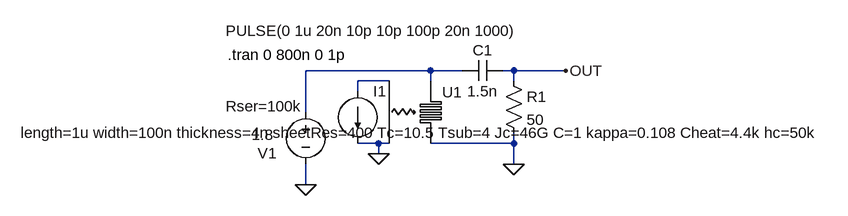
[diagram p0: schematic snspd-biasing-drift.asc]
snspd-biasing-drift.asc, the LTspice schematic file:
Version 4
SHEET 1 880 680
WIRE 208 32 16 32
WIRE 256 32 208 32
WIRE 336 32 320 32
WIRE 416 32 336 32
WIRE 144 48 96 48
WIRE 208 48 208 32
WIRE 336 48 336 32
WIRE 96 64 96 48
WIRE 16 96 16 32
WIRE 128 144 96 144
WIRE 144 144 128 144
WIRE 336 144 336 128
WIRE 336 144 208 144
WIRE 128 160 128 144
WIRE 336 176 336 144
WIRE 16 208 16 176
FLAG 128 160 0
FLAG 16 208 0
FLAG 416 32 OUT
FLAG 336 176 0
SYMBOL snspdWithPhotonPort 208 96 R0
WINDOW 0 18 -31 Left 2
SYMATTR InstName U1
SYMATTR Value Lind=100n Isw=20u Tsub=2.7
SYMBOL res 320 32 R0
SYMATTR InstName R1
SYMATTR Value 50
SYMBOL current 96 64 R0
WINDOW 3 -203 -93 Left 2
WINDOW 123 0 0 Left 2
WINDOW 39 0 0 Left 2
SYMATTR Value PULSE(0 1u 20n 10p 10p 100p 20n 1000)
SYMATTR InstName I1
SYMBOL voltage 16 80 R0
WINDOW 0 -74 79 Left 2
WINDOW 3 -83 51 Left 2
WINDOW 123 0 0 Left 2
WINDOW 39 -123 7 Left 2
SYMATTR InstName V1
SYMATTR Value 1.8
SYMATTR SpiceLine Rser=100k
SYMBOL cap 320 16 R90
WINDOW 0 0 32 VBottom 2
WINDOW 3 32 32 VTop 2
SYMATTR InstName C1
SYMATTR Value 1.5n
TEXT -104 8 Left 2 !.tran 0 800n 0 1p

The netlist it stands for:
* snspd-biasing-drift.asc
XU1 N002 0 N001 0 nanowireDynamic Lind=100n Isw=20u Tsub=2.7 length=1u width=100n thickness=4n sheetRes=400 Tc=10.5 Tsub=4 Jc=46G C=1 kappa=0.108 Cheat=4.4k hc=50k  ; pins gate-in photon-out source drain
R1 OUT 0 50
I1 N002 0 PULSE(0 1u 20n 10p 10p 100p 20n 1000)
V1 N001 0 1.8 Rser=100k
C1 OUT N001 1.5n
.tran 0 800n 0 1p
.lib snspd.lib
.backanno
.end